# Altium project OBC_v8.PrjPcb
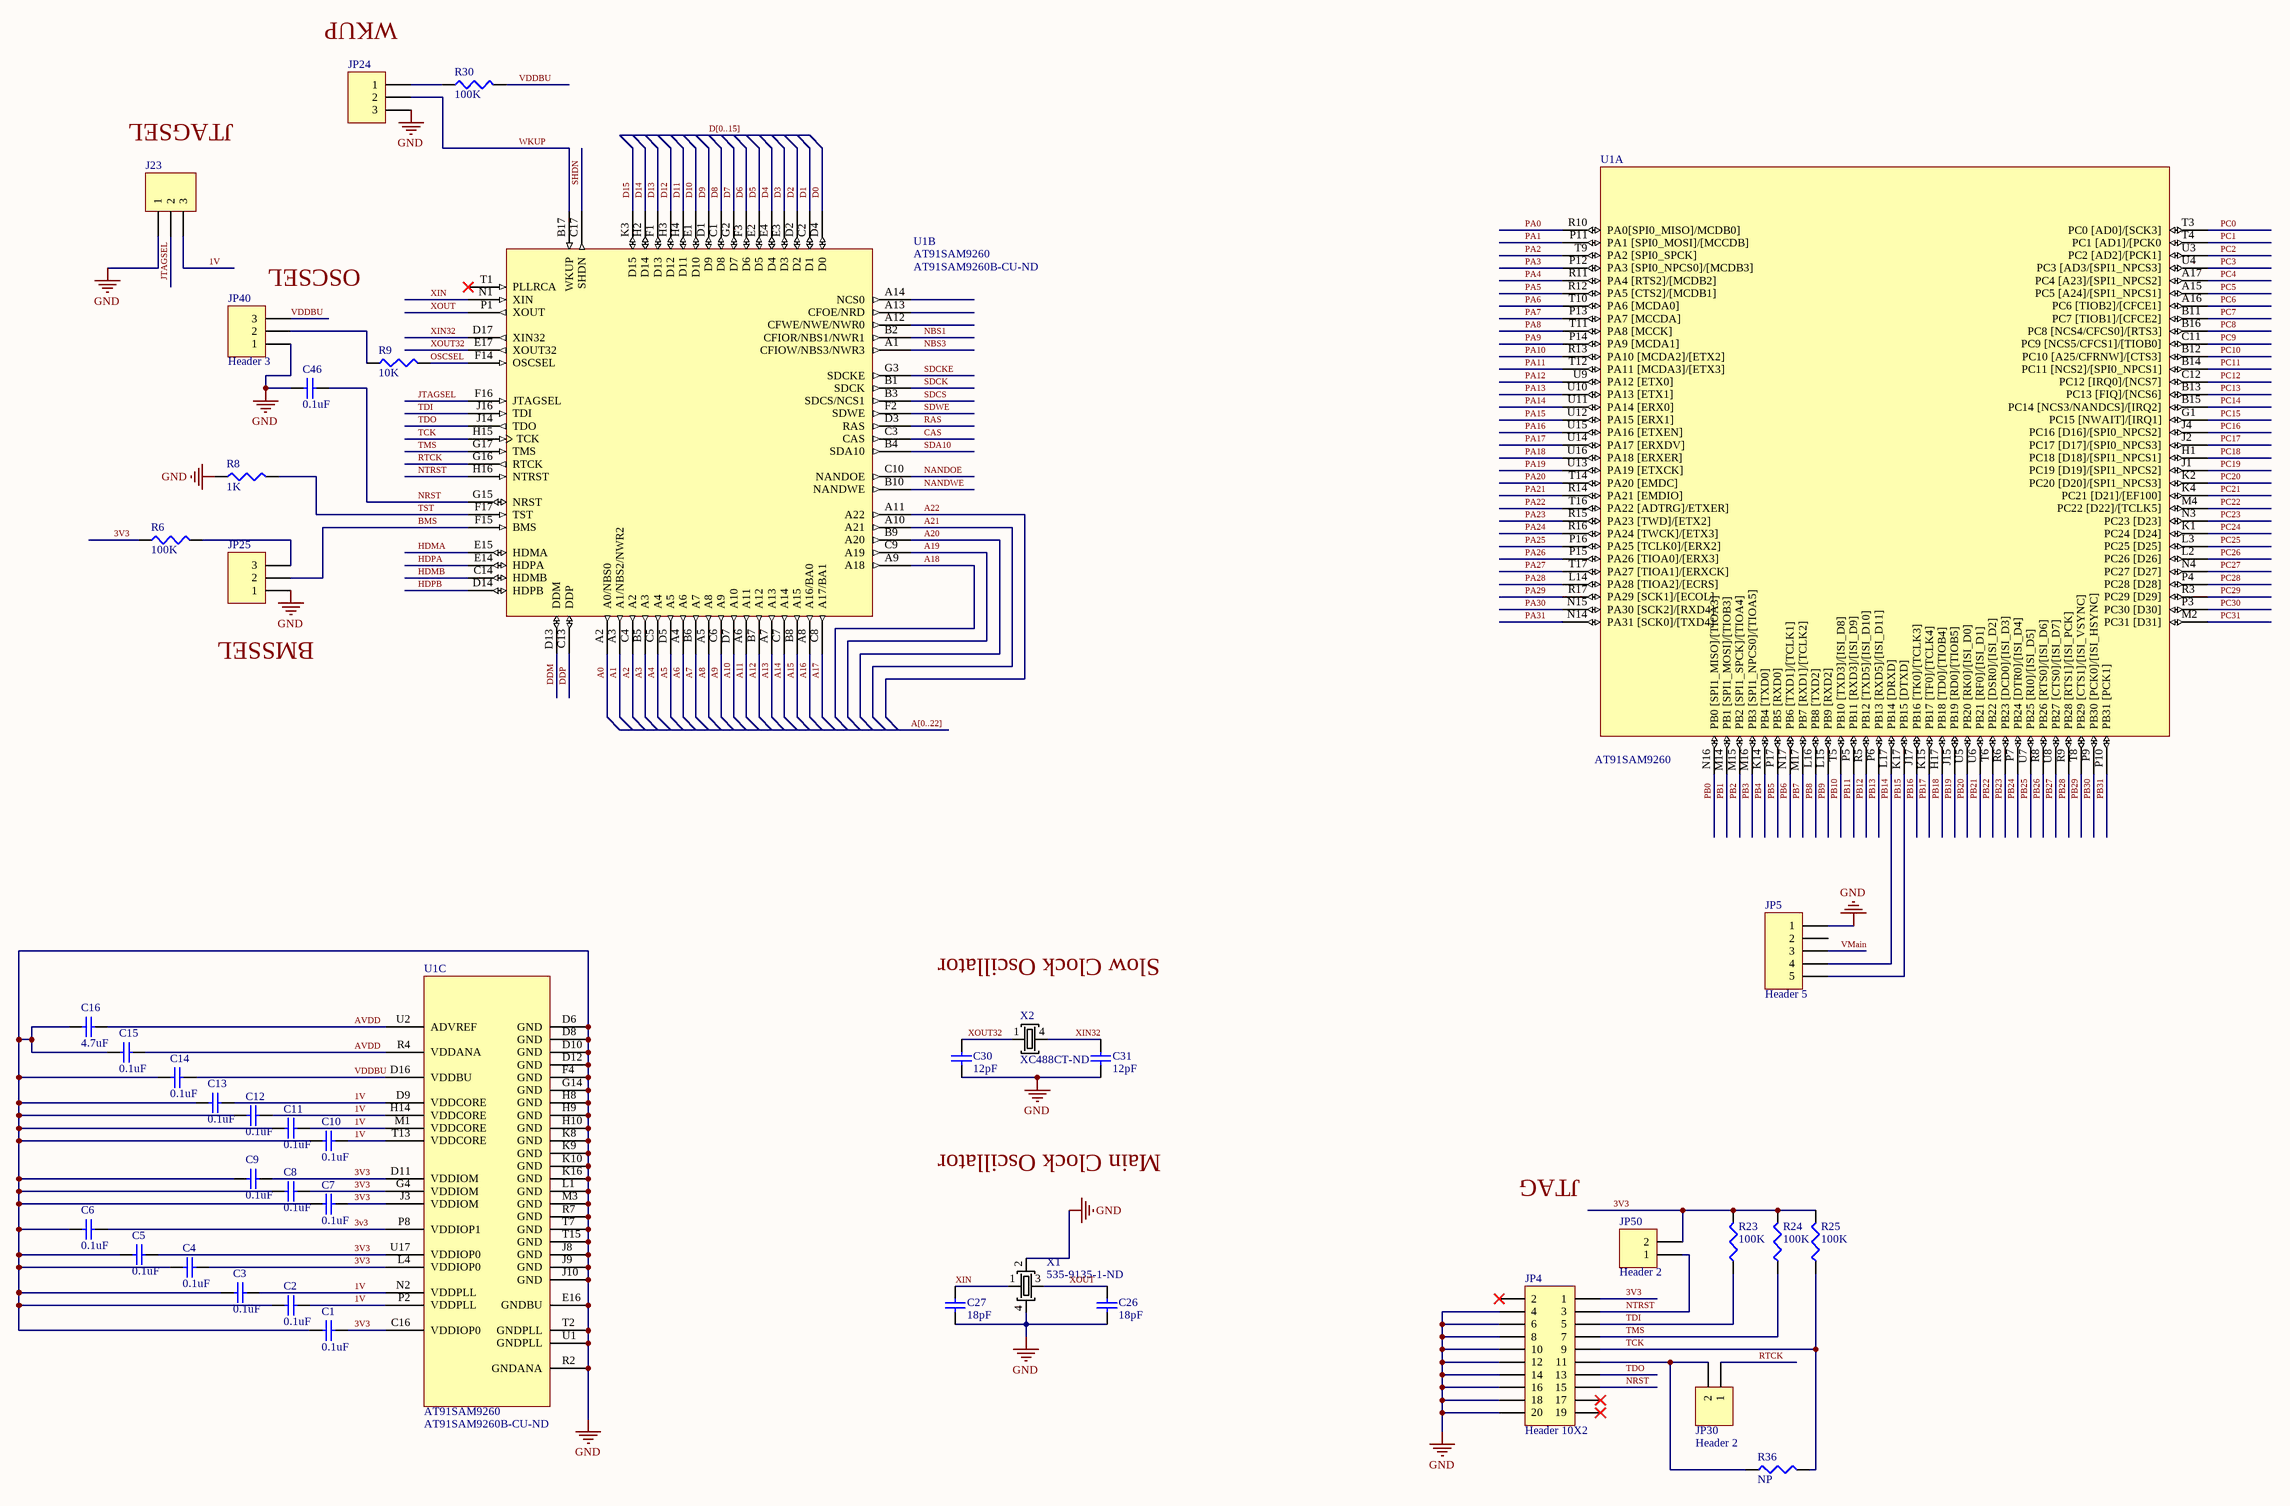
[diagram p0: MCU.SchDoc]
4 sheets, 107 parts. Net scope: global (net labels, ports and power ports of the same name join across sheets).
Board file: OBC_v8.PcbDoc
Sheets:
  MCU.SchDoc
  Power_Regulator.SchDoc
  SDCARD.SchDoc
  Ethernet.SchDoc

## Sheet MCU.SchDoc: YUsend-QB50 OBC
size A2; DrawnBy: Konstantin Borschiov; Revision: B; SheetNumber: 1; SheetTotal: 2

### Parts
C1  value 0.1uF  [0402]  (hidden comment: C0402_c_0.1uF)
C2  value 0.1uF  [0402]  (hidden comment: C0402_c_0.1uF)
C3  value 0.1uF  [0402]  (hidden comment: C0402_c_0.1uF)
C4  value 0.1uF  [0402]  (hidden comment: C0402_c_0.1uF)
C5  value 0.1uF  [0402]  (hidden comment: C0402_c_0.1uF)
C6  value 0.1uF  [0402]  (hidden comment: C0402_c_0.1uF)
C7  value 0.1uF  [0402]  (hidden comment: C0402_c_0.1uF)
C8  value 0.1uF  [0402]  (hidden comment: C0402_c_0.1uF)
C9  value 0.1uF  [0402]  (hidden comment: C0402_c_0.1uF)
C10  value 0.1uF  [0402]  (hidden comment: C0402_c_0.1uF)
C11  value 0.1uF  [0402]  (hidden comment: C0402_c_0.1uF)
C12  value 0.1uF  [0402]  (hidden comment: C0402_c_0.1uF)
C13  value 0.1uF  [0402]  (hidden comment: C0402_c_0.1uF)
C14  value 0.1uF  [0402]  (hidden comment: C0402_c_0.1uF)
C15  value 0.1uF  [0402]  (hidden comment: C0402_c_0.1uF)
C16  value 4.7uF  [0402]  (hidden comment: C0402_c_4.7uF)
C26  value 18pF  [0402]  (hidden comment: C0402_a_18pF)
C27  value 18pF  [0402]  (hidden comment: C0402_a_18pF)
C30  value 12pF  [0402]  (hidden comment: C0402_a_12pF)
C31  value 12pF  [0402]  (hidden comment: C0402_a_12pF)
C46  value 0.1uF  [0402]  (hidden comment: C0402_c_0.1uF)
J23  Header 3  [HDR1X3]  (value not drawn)
JP4  Header 10X2  [HDR2X10]
JP5  Header 5  [HDR1X5]
JP24  Header 3  [HDR1X3]  (value not drawn)
JP25  Header 3  [HDR1X3]  (value not drawn)
JP30  Header 2  [HDR1X2]
JP40  Header 3  [HDR1X3]
JP50  Header 2  [HDR1X2]
R6  value 100K  [RES0805]  (hidden comment: Susumu_0805_b3_100K)
R8  value 1K  [RES0805]  (hidden comment: Susumu_0805_b1_1K)
R9  value 10K  [RES0805]  (hidden comment: Susumu_0805_b2_10K)
R23  value 100K  [RES0805]  (hidden comment: Susumu_0805_b3_100K)
R24  value 100K  [RES0805]  (hidden comment: Susumu_0805_b3_100K)
R25  value 100K  [RES0805]  (hidden comment: Susumu_0805_b3_100K)
R30  value 100K  [RES0805]  (hidden comment: Susumu_0805_b3_100K)
R36  value NP  [RES0805]  (hidden comment: 0805_NP)
U1  AT91SAM9260  [BGA217C80P17X17_1500X1500X140]  (parts A,B,C of 3)
X1  Supplier Part Number 1: 535-9135-1-ND  [Crystal Footprint]  (hidden comment: Crystal_18.432MHz)
X2  Supplier Part Number 1: XC488CT-ND  [ECX-306]  (hidden comment: Crystal_32.768KHz)

### Nets
GND: C1.1 C2.1 C3.1 C4.1 C5.1 C6.1 C7.1 C8.1 C9.1 C10.1 C11.1 C12.1 C13.1 C14.1 C15.1 C16.1 C26.1 C27.1 C30.1 C31.1 C46.1 J23.1 JP4.4 JP4.6 JP4.8 JP4.10 JP4.12 JP4.14 JP4.16 JP4.18 JP4.20 JP5.1 JP24.3 JP25.1 JP40.1 R8.1 U1.D6(GND) U1.D8(GND) U1.D10(GND) U1.D12(GND) U1.E16(GNDBU) U1.F4(GND) U1.G14(GND) U1.H8(GND) U1.H9(GND) U1.H10(GND) U1.J8(GND) U1.J9(GND) U1.J10(GND) U1.K8(GND) U1.K9(GND) U1.K10(GND) U1.K16(GND) U1.L1(GND) U1.M3(GND) U1.R2(GNDANA) U1.R7(GND) U1.T2(GNDPLL) U1.T7(GND) U1.T15(GND) U1.U1(GNDPLL) X1.2(GND) X1.4(GND)
1V: C2.2 C3.2 C10.2 C11.2 C12.2 C13.2 J23.3 U1.D9(VDDCORE) U1.H14(VDDCORE) U1.M1(VDDCORE) U1.N2(VDDPLL) U1.P2(VDDPLL) U1.T13(VDDCORE)
3V3: C1.2 C4.2 C5.2 C6.2 C7.2 C8.2 C9.2 JP4.1 JP50.2 R6.1 R23.2 R24.2 R25.2 U1.C16(VDDIOP0) U1.D11(VDDIOM) U1.G4(VDDIOM) U1.J3(VDDIOM) U1.L4(VDDIOP0) U1.P8(VDDIOP1) U1.U17(VDDIOP0)
A0: U1.A2(A0/NBS0)
A1: U1.A3(A1/NBS2/NWR2)
A2: U1.C4(A2)
A3: U1.B5(A3)
A4: U1.C5(A4)
A5: U1.D5(A5)
A6: U1.A4(A6)
A7: U1.B6(A7)
A8: U1.A5(A8)
A9: U1.C6(A9)
A10: U1.D7(A10)
A11: U1.A6(A11)
A12: U1.B7(A12)
A13: U1.A7(A13)
A14: U1.C7(A14)
A15: U1.B8(A15)
A16: U1.A8(A16/BA0)
A17: U1.C8(A17/BA1)
A18: U1.A9(A18)
A19: U1.C9(A19)
A20: U1.B9(A20)
A21: U1.A10(A21)
A22: U1.A11(A22)
AVDD: C15.2 C16.2 U1.R4(VDDANA) U1.U2(ADVREF)
BMS: JP25.2 U1.F15(BMS)
CAS: U1.C3(CAS)
D0: U1.D4(D0)
D1: U1.C2(D1)
D2: U1.D2
D3: U1.E3(D3)
D4: U1.E4(D4)
D5: U1.E2(D5)
D6: U1.F3(D6)
D7: U1.G2(D7)
D8: U1.C1(D8)
D9: U1.D1(D9)
D10: U1.E1(D10)
D11: U1.H4(D11)
D12: U1.H3(D12)
D13: U1.F1(D13)
D14: U1.H2(D14)
D15: U1.K3(D15)
DDM: U1.D13(DDM)
DDP: U1.C13(DDP)
HDMA: U1.E15(HDMA)
HDMB: U1.C14(HDMB)
HDPA: U1.E14(HDPA)
HDPB: U1.D14(HDPB)
JTAGSEL: J23.2 U1.F16(JTAGSEL)
NANDOE: U1.C10(NANDOE)
NANDWE: U1.B10(NANDWE)
NBS1: U1.B2(CFIOR/NBS1/NWR1)
NBS3: U1.A1(CFIOW/NBS3/NWR3)
NRST: C46.2 JP4.15 U1.G15(NRST)
NTRST: JP4.3 JP50.1 U1.H16(NTRST)
OSCSEL: R9.2 U1.F14(OSCSEL)
PA0: U1.R10(PA0[SPI0_MISO]/MCDB0])
PA1: U1.P11(PA1_[SPI0_MOSI]/[MCCDB])
PA2: U1.T9(PA2_[SPI0_SPCK])
PA3: U1.P12(PA3_[SPI0_NPCS0]/[MCDB3])
PA4: U1.R11(PA4_[RTS2]/[MCDB2])
PA5: U1.R12(PA5_[CTS2]/[MCDB1])
PA6: U1.T10(PA6_[MCDA0])
PA7: U1.P13(PA7_[MCCDA])
PA8: U1.T11(PA8_[MCCK])
PA9: U1.P14(PA9_[MCDA1])
PA10: U1.R13(PA10_[MCDA2]/[ETX2])
PA11: U1.T12(PA11_[MCDA3]/[ETX3])
PA12: U1.U9(PA12_[ETX0])
PA13: U1.U10(PA13_[ETX1])
PA14: U1.U11(PA14_[ERX0])
PA15: U1.U12(PA15_[ERX1])
PA16: U1.U15(PA16_[ETXEN])
PA17: U1.U14(PA17_[ERXDV])
PA18: U1.U16(PA18_[ERXER])
PA19: U1.U13(PA19_[ETXCK])
PA20: U1.T14(PA20_[EMDC])
PA21: U1.R14(PA21_[EMDIO])
PA22: U1.T16(PA22_[ADTRG]/ETXER])
PA23: U1.R15(PA23_[TWD]/[ETX2])
PA24: U1.R16(PA24_[TWCK]/[ETX3])
PA25: U1.P16(PA25_[TCLK0]/[ERX2])
PA26: U1.P15(PA26_[TIOA0]/[ERX3])
PA27: U1.T17(PA27_[TIOA1]/[ERXCK])
PA28: U1.L14(PA28_[TIOA2]/[ECRS])
PA29: U1.R17(PA29_[SCK1]/[ECOL])
PA30: U1.N15(PA30_[SCK2]/[RXD4])
PA31: U1.N14(PA31_[SCK0]/[TXD4])
PB0: U1.N16(PB0_[SPI1_MISO]/[TIOA3])
PB1: U1.M14(PB1_[SPI1_MOSI]/[TIOB3])
PB2: U1.M15(PB2_[SPI1_SPCK]/[TIOA4])
PB3: U1.M16(PB3_[SPI1_NPCS0]/[TIOA5])
PB4: U1.K14(PB4_[TXD0])
PB5: U1.P17(PB5_[RXD0])
PB6: U1.N17(PB6_[TXD1]/[TCLK1])
PB7: U1.M17(PB7_[RXD1]/[TCLK2])
PB8: U1.L16(PB8_[TXD2])
PB9: U1.L15(PB9_[RXD2])
PB10: U1.T5(PB10_[TXD3]/[ISI_D8])
PB11: U1.P5(PB11_[RXD3]/[ISI_D9])
PB12: U1.R5(PB12_[TXD5]/[ISI_D10])
PB13: U1.P6(PB13_[RXD5]/[ISI_D11])
PB14: JP5.4 U1.L17(PB14_[DRXD])
PB15: JP5.5 U1.K17(PB15_[DTXD])
PB16: U1.J17(PB16_[TK0]/[TCLK3])
PB17: U1.K15(PB17_[TF0]/[TCLK4])
PB18: U1.H17(PB18_[TD0]/[TIOB4])
PB19: U1.J15(PB19_[RD0]/[TIOB5])
PB20: U1.U5(PB20_[RK0]/[ISI_D0])
PB21: U1.U6(PB21_[RF0]/[ISI_D1])
PB22: U1.T6(PB22_[DSR0]/[ISI_D2])
PB23: U1.R6(PB23_[DCD0]/[ISI_D3])
PB24: U1.P7(PB24_[DTR0]/[ISI_D4])
PB25: U1.U7(PB25_[RI0]/[ISI_D5])
PB26: U1.R8(PB26_[RTS0]/[ISI_D6])
PB27: U1.U8(PB27_[CTS0]/[ISI_D7])
PB28: U1.R9(PB28_[RTS1]/[ISI_PCK])
PB29: U1.T8(PB29_[CTS1]/[ISI_VSYNC])
PB30: U1.P9(PB30_[PCK0]/[ISI_HSYNC])
PB31: U1.P10(PB31_[PCK1])
PC0: U1.T3(PC0_[AD0]/[SCK3])
PC1: U1.T4(PC1_[AD1]/[PCK0)
PC2: U1.U3(PC2_[AD2]/[PCK1])
PC3: U1.U4(PC3_[AD3/[SPI1_NPCS3])
PC4: U1.A17(PC4_[A23]/[SPI1_NPCS2])
PC5: U1.A15(PC5_[A24]/[SPI1_NPCS1])
PC6: U1.A16(PC6_[TIOB2]/[CFCE1])
PC7: U1.B11(PC7_[TIOB1]/[CFCE2])
PC8: U1.B16(PC8_[NCS4/CFCS0]/[RTS3])
PC9: U1.C11(PC9_[NCS5/CFCS1]/[TIOB0])
PC10: U1.B12(PC10_[A25/CFRNW]/[CTS3])
PC11: U1.B14(PC11_[NCS2]/[SPI0_NPCS1])
PC12: U1.C12(PC12_[IRQ0]/[NCS7])
PC13: U1.B13(PC13_[FIQ]/[NCS6])
PC14: U1.B15(PC14_[NCS3/NANDCS]/[IRQ2])
PC15: U1.G1(PC15_[NWAIT]/[IRQ1])
PC16: U1.J4(PC16_[D16]/[SPI0_NPCS2])
PC17: U1.J2(PC17_[D17]/[SPI0_NPCS3])
PC18: U1.H1(PC18_[D18]/[SPI1_NPCS1])
PC19: U1.J1(PC19_[D19]/[SPI1_NPCS2])
PC20: U1.K2(PC20_[D20]/[SPI1_NPCS3])
PC21: U1.K4(PC21_[D21]/[EF100])
PC22: U1.M4(PC22_[D22]/[TCLK5])
PC23: U1.N3(PC23_[D23])
PC24: U1.K1(PC24_[D24])
PC25: U1.L3(PC25_[D25])
PC26: U1.L2(PC26_[D26])
PC27: U1.N4(PC27_[D27])
PC28: U1.P4(PC28_[D28])
PC29: U1.R3(PC29_[D29])
PC30: U1.P3(PC30_[D30])
PC31: U1.M2(PC31_[D31])
RAS: U1.D3(RAS)
RTCK: JP30.1 U1.G16(RTCK)
SDA10: U1.B4(SDA10)
SDCK: U1.B1(SDCK)
SDCKE: U1.G3(SDCKE)
SDCS: U1.B3(SDCS/NCS1)
SDWE: U1.F2(SDWE)
SHDN: U1.C17(SHDN)
TCK: JP4.9 R25.1 R36.2 U1.H15(TCK)
TDI: JP4.5 R23.1 U1.J16(TDI)
TDO: JP4.13 U1.J14(TDO)
TMS: JP4.7 R24.1 U1.G17(TMS)
TST: R8.2 U1.F17(TST)
VDDBU: C14.2 JP40.3 R30.2 U1.D16(VDDBU)
VMain: JP5.3
WKUP: JP24.2 U1.B17(WKUP)
XIN: C27.2 U1.N1(XIN) X1.1
XIN32: C31.2 U1.D17(XIN32) X2.4(GND)
XOUT: C26.2 U1.P1(XOUT) X1.3
XOUT32: C30.2 U1.E17(XOUT32) X2.1
NetJP4_11: JP4.11 JP30.2 R36.1
NetJP24_1: JP24.1 R30.1
NetJP25_3: JP25.3 R6.2
NetJP40_2: JP40.2 R9.1

Not connected (* = marked no-connect by the designer): JP4 2* 17* 19*; JP5 2; U1 A12(CFWE/NWE/NWR0) A13(CFOE/NRD) A14(NCS0) T1(PLLRCA)*

### Buses and harness runs
bus A[0..22]
bus D[0..15]

### Notes on the sheet
- (near JP24) WKUP
- JTAGSEL
- (near JP40) OSCSEL
- (near JP25) BMSSEL
- Slow Clock Oscillator
- Main Clock Oscillator
- JTAG

### Library data of the parts
C1-C15 C46 = C0402_c_0.1uF: Ceramic Chip Capacitor - 0.1uF; Note: Footprint corresponds to dimensions for bulk cassette packaging. This case size has tightened tolerances.; Published: 17-Jul-2002; LatestRevisionDate: 19-Mar-2004; LatestRevisionNote: Silkscreen size reduced.; DatasheetDocument: Mar-2001; PackageDocument: Mar-2001; PackageReference: 0402; Publisher: Altium Limited; Code_JEITA: 0402; Code_IPC: 1005 [0402]; ComponentLink1Description: Manufacturer Link; ComponentLink1URL: http://www.kemet.com/; ComponentLink2Description: Datasheet; ComponentLink2URL: http://www.kemet.com/kemet/web/homepage/kechome.nsf/vapubfilesname/F3102TA.pdf/$file/F3102TA.pdf; Supplier 1: Digi-Key; Supplier Part Number 1: 399-3521-1-ND
C16 = C0402_c_4.7uF: Ceramic Chip Capacitor - 4.7uF; Note: Footprint corresponds to dimensions for bulk cassette packaging. This case size has tightened tolerances.; Published: 17-Jul-2002; LatestRevisionDate: 19-Mar-2004; LatestRevisionNote: Silkscreen size reduced.; DatasheetDocument: Mar-2001; PackageDocument: Mar-2001; PackageReference: 0402; Publisher: Altium Limited; Code_JEITA: 0402; Code_IPC: 1005 [0402]; ComponentLink1Description: Manufacturer Link; ComponentLink1URL: http://www.kemet.com/; ComponentLink2Description: Datasheet; ComponentLink2URL: http://www.kemet.com/kemet/web/homepage/kechome.nsf/vapubfilesname/F3102TA.pdf/$file/F3102TA.pdf; Supplier 1: Digi-Key; Supplier Part Number 1: 490-5408-1-ND
C26 C27 = C0402_a_18pF: Ceramic Chip Capacitor - 18pF; Note: Footprint corresponds to dimensions for bulk cassette packaging. This case size has tightened tolerances.; Published: 17-Jul-2002; LatestRevisionDate: 19-Mar-2004; LatestRevisionNote: Silkscreen size reduced.; DatasheetDocument: Mar-2001; PackageDocument: Mar-2001; PackageReference: 0402; Publisher: Altium Limited; Code_JEITA: 0402; Code_IPC: 1005 [0402]; ComponentLink1Description: Manufacturer Link; ComponentLink1URL: http://www.kemet.com/; ComponentLink2Description: Datasheet; ComponentLink2URL: http://www.kemet.com/kemet/web/homepage/kechome.nsf/vapubfilesname/F3102TA.pdf/$file/F3102TA.pdf; Supplier 1: Digi-Key; Supplier Part Number 1: 490-1281-1-ND
C30 C31 = C0402_a_12pF: Ceramic Chip Capacitor - 12pF; Note: Footprint corresponds to dimensions for bulk cassette packaging. This case size has tightened tolerances.; Published: 17-Jul-2002; LatestRevisionDate: 19-Mar-2004; LatestRevisionNote: Silkscreen size reduced.; DatasheetDocument: Mar-2001; PackageDocument: Mar-2001; PackageReference: 0402; Publisher: Altium Limited; Code_JEITA: 0402; Code_IPC: 1005 [0402]; ComponentLink1Description: Manufacturer Link; ComponentLink1URL: http://www.kemet.com/; ComponentLink2Description: Datasheet; ComponentLink2URL: http://www.kemet.com/kemet/web/homepage/kechome.nsf/vapubfilesname/F3102TA.pdf/$file/F3102TA.pdf; Supplier 1: Digi-Key; Supplier Part Number 1: 490-1279-1-ND
J23 JP24 JP25 JP40 = Header 3: Header, 3-Pin; LatestRevisionDate: 17-Jul-2002; LatestRevisionNote: Re-released for DXP Platform.; Publisher: Altium Limited
JP4 = Header 10X2: Header, 10-Pin, Dual row; LatestRevisionDate: 17-Jul-2002; LatestRevisionNote: Re-released for DXP Platform.; Publisher: Altium Limited
JP5 = Header 5: Header, 5-Pin; LatestRevisionDate: 17-Jul-2002; LatestRevisionNote: Re-released for DXP Platform.; Publisher: Altium Limited
JP30 JP50 = Header 2: Header, 2-Pin; LatestRevisionDate: 17-Jul-2002; LatestRevisionNote: Re-released for DXP Platform.; Publisher: Altium Limited
R6 R23-R25 R30 = Susumu_0805_b3_100K: RES 100K OHM 1/10W .5% 0805 SMD; Supplier 1: Digi-Key; Supplier Part Number 1: RR12P100KDCT-ND
R8 = Susumu_0805_b1_1K: RES 1.0K OHM 1/10W .5% 0805 SMD; Supplier 1: Digi-Key; Supplier Part Number 1: RR12P1.0KDCT-ND
R9 = Susumu_0805_b2_10K: RES 10.0K OHM 1/10W .5% 0805 SMD; Supplier 1: Digi-Key; Supplier Part Number 1: RR12P10.0KDCT-ND
R36 = 0805_NP: No populate
U1 = AT91SAM9260: ARM926EJ-S 32 bit RISC CPU, 217-Ball BGA; Note: The pin names in [ ] brackets indicate peripheral multiplexing function.; ComponentLink1Description: Manufacturer Link; ComponentLink1URL: http://www.atmel.com; ComponentLink2Description: Datasheet; ComponentLink2URL: http://www.atmel.com/dyn/resources/prod_documents/doc6221.pdf; DatasheetVersion: 6221I-ATARM-17-Jul-09; PackageDescription: 217-Ball Ball Grid Array 0.8 mm Pitch; PackageReference: BGA217; Supplier 1: Digi-Key
X1 = Crystal_18.432MHz: Crystal 18.432MHz 18PF SMD; Manufacturer: Abracon Corporation; Value: 18.432MHz; Supplier 1: Digi-Key
X2 = Crystal_32.768KHz: Crystal 32.768KHz 12.5PF SMD; Value: 32.768KHz; Supplier 1: Digi-Key

## Sheet Power_Regulator.SchDoc: Power Regulator
size A4; SheetNumber: 2; SheetTotal: 2
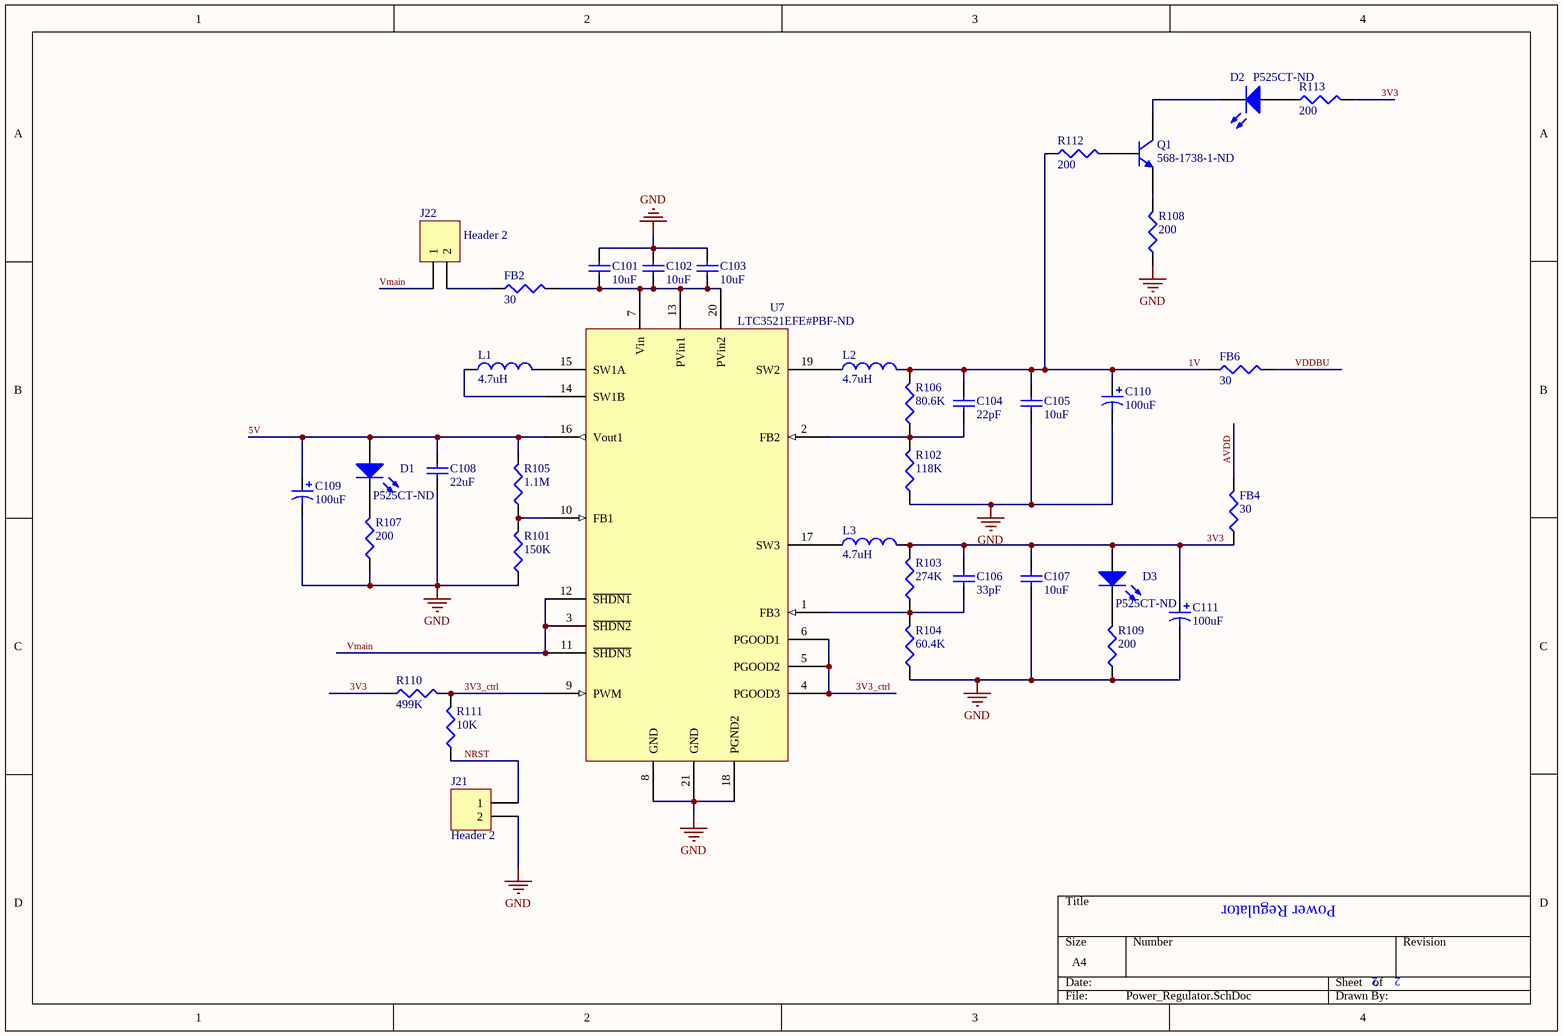
[diagram p1: Power_Regulator.SchDoc]

### Parts
C101  value 10uF  [0805]  (hidden comment: C0805_c_10uF)
C102  value 10uF  [0805]  (hidden comment: C0805_c_10uF)
C103  value 10uF  [0805]  (hidden comment: C0805_c_10uF)
C104  value 22pF  [CAPC2008X06N]  (hidden comment: AVX_0805_a2_22pf)
C105  value 10uF  [0805]  (hidden comment: C0805_c_10uF)
C106  value 33pF  [CAPC2008X06N]  (hidden comment: AVX_0805_a3_33pf)
C107  value 10uF  [0805]  (hidden comment: C0805_c_10uF)
C108  value 22uF  [0805]  (hidden comment: C0805_c_22uF)
C109  value 100uF  [6032]  (hidden comment: TantCap_6032_100uF)
C110  value 100uF  [6032]  (hidden comment: TantCap_6032_100uF)
C111  value 100uF  [6032]  (hidden comment: TantCap_6032_100uF)
D1  Supplier Part Number 1: P525CT-ND  [LED]  (hidden comment: LED_Green)
D2  Supplier Part Number 1: P525CT-ND  [LED]  (hidden comment: LED_Green)
D3  Supplier Part Number 1: P525CT-ND  [LED]  (hidden comment: LED_Green)
FB2  Value @ 100MHz: 30  [0805]  (hidden comment: Murata_a_0805_30_Ohm_100Mhz)
FB4  Value @ 100MHz: 30  [0805]  (hidden comment: Murata_a_0805_30_Ohm_100Mhz)
FB6  Value @ 100MHz: 30  [0805]  (hidden comment: Murata_a_0805_30_Ohm_100Mhz)
J21  Header 2  [HDR1X2]
J22  Header 2  [HDR1X2]
L1  value 4.7uH  [L1812]  (hidden comment: L1812_4.7uH)
L2  value 4.7uH  [L1812]  (hidden comment: L1812_4.7uH)
L3  value 4.7uH  [L1812]  (hidden comment: L1812_4.7uH)
Q1  Supplier Part Number 1: 568-1738-1-ND  [SOT95P230X110-3N]  (hidden comment: NPN Transistor)
R101  value 150K  [RES0805]  (hidden comment: Panasonic_0805_b_150K)
R102  value 118K  [RES0805]  (hidden comment: Susumu_0805_c_118K)
R103  value 274K  [RES0805]  (hidden comment: TE_0805_a_274K)
R104  value 60.4K  [RES0805]  (hidden comment: Susumu_0805_a_60.4K)
R105  value 1.1M  [RES0805]  (hidden comment: TE_0805_c_1.1K)
R106  value 80.6K  [RES0805]  (hidden comment: Susumu_0805_b_80.6K)
R107  value 200  [RES0805]  (hidden comment: Susumu_0805_a3_200)
R108  value 200  [RES0805]  (hidden comment: Susumu_0805_a3_200)
R109  value 200  [RES0805]  (hidden comment: Susumu_0805_a3_200)
R110  value 499K  [RES0805]  (hidden comment: Susumu_0805_c3_499K)
R111  value 10K  [RES0805]  (hidden comment: Susumu_0805_b2_10K)
R112  value 200  [RES0805]  (hidden comment: Susumu_0805_a3_200)
R113  value 200  [RES0805]  (hidden comment: Susumu_0805_a3_200)
U7  Supplier Part Number 1: LTC3521EFE#PBF-ND  [LTC3521EFE#PBF - duplicate]  (hidden comment: LTC3521EFE#PBF)

### Nets
GND: C101.2 C102.2 C103.2 C105.1 C107.1 C108.1 C109.2 C110.2 C111.2 J21.2 R101.1 R102.1 R104.1 R107.1 R108.1 R109.1 U7.8(GND) U7.18(PGND2) U7.21(GND)
1V: C104.2 C105.2 C110.1 FB6.1 L2.2 R106.2 R112.1
3V3: C106.2 C107.2 C111.1 D3.1(A) FB4.1 L3.2 R103.2 R110.1 R113.2
3V3_ctrl: R110.2 R111.2 U7.4(PGOOD3) U7.5(PGOOD2) U7.6(PGOOD1) U7.9(PWM)
5V: C108.2 C109.1 D1.1(A) R105.2 U7.16(Vout1)
AVDD: FB4.2
NRST: J21.1 R111.1
VDDBU: FB6.2
VMain: J22.1 U7.3(~{SHDN2}) U7.11(~{SHDN3}) U7.12(~{SHDN1})
NetC101_1: C101.1 C102.1 C103.1 FB2.2 U7.7(Vin) U7.13(PVin1) U7.20(PVin2)
NetC104_1: C104.1 R102.2 R106.1 U7.2(FB2)
NetC106_1: C106.1 R103.1 R104.2 U7.1(FB3)
NetD1_2: D1.2(K) R107.2
NetD2_1: D2.1(A) R113.1
NetD2_2: D2.2(K) Q1.3(C)
NetD3_2: D3.2(K) R109.2
NetFB2_1: FB2.1 J22.2
NetL1_1: L1.1 U7.14(SW1B)
NetL1_2: L1.2 U7.15(SW1A)
NetL2_1: L2.1 U7.19(SW2)
NetL3_1: L3.1 U7.17(SW3)
NetQ1_1: Q1.1(B) R112.2
NetQ1_2: Q1.2(E) R108.2
NetR101_2: R101.2 R105.1 U7.10(FB1)

### Library data of the parts
C101-C103 C105 C107 = C0805_c_10uF: Ceramic Chip Capacitor - 10uF; Note: Footprint corresponds to dimensions for bulk cassette packaging. This case size has tightened tolerances.; Published: 17-Jul-2002; LatestRevisionDate: 19-Mar-2004; LatestRevisionNote: Silkscreen size reduced.; DatasheetDocument: Mar-2001; PackageDocument: Mar-2001; PackageReference: 0805; Publisher: Altium Limited; Code_JEITA: 0805; Code_IPC: 2012[0805]; ComponentLink1Description: Manufacturer Link; ComponentLink1URL: http://www.kemet.com/; ComponentLink2Description: Datasheet; ComponentLink2URL: http://www.kemet.com/kemet/web/homepage/kechome.nsf/vapubfilesname/F3102TA.pdf/$file/F3102TA.pdf; Supplier 1: Digi-Key; Supplier Part Number 1: 587-1299-1-ND
C104 = AVX_0805_a2_22pf: CAP CER 22PF 50V 5% NP0 0805; Supplier 1: Digi-Key; Supplier Part Number 1: 478-1308-1-ND
C106 = AVX_0805_a3_33pf: CAP CER 33PF 50V 5% NP0 0805; Supplier 1: Digi-Key; Supplier Part Number 1: 478-1310-1-ND
C108 = C0805_c_22uF: Ceramic Chip Capacitor - 22uF; Note: Footprint corresponds to dimensions for bulk cassette packaging. This case size has tightened tolerances.; Published: 17-Jul-2002; LatestRevisionDate: 19-Mar-2004; LatestRevisionNote: Silkscreen size reduced.; DatasheetDocument: Mar-2001; PackageDocument: Mar-2001; PackageReference: 0805; Publisher: Altium Limited; Code_JEITA: 0805; Code_IPC: 2012[0805]; ComponentLink1Description: Manufacturer Link; ComponentLink1URL: http://www.kemet.com/; ComponentLink2Description: Datasheet; ComponentLink2URL: http://www.kemet.com/kemet/web/homepage/kechome.nsf/vapubfilesname/F3102TA.pdf/$file/F3102TA.pdf; Supplier 1: Digi-Key; Supplier Part Number 1: 587-1468-1-ND
C109-C111 = TantCap_6032_100uF: CAP TANT 100UF 10V 10% LOESR SMD; Code_JEITA: 6032; ComponentLink1Description: Manufacturer Link; ComponentLink1URL: http://www.kemet.com; ComponentLink2Description: Datasheet; ComponentLink2URL: http://www.kemet.com/kemet/web/homepage/kechome.nsf/vapubfiles/B45197A_SpeedPower.pdf/$file/B45197A_SpeedPower.pdf; Supplier 1: Digi-Key; Supplier Part Number 1: 495-1528-1-ND
D1-D3 = LED_Green: LED GREEN HI BRT SS TYPE LO CUR; Manufacturer: Panasonic; Colour: green; Supplier 1: Digi-Key
FB2 FB4 FB6 = Murata_a_0805_30_Ohm_100Mhz: FERRITE CHIP 30 OHM 3000MA 0805; Supplier 1: Digi-Key; Supplier Part Number 1: 490-1052-1-ND
J21 J22 = Header 2: Header, 2-Pin; LatestRevisionDate: 17-Jul-2002; LatestRevisionNote: Re-released for DXP Platform.; Publisher: Altium Limited
L1-L3 = L1812_4.7uH: Inductor unshielded 4.7mH 1812 SMD; ComponentLink1Description: Manufacturer Link; ComponentLink1URL: http://www.delevan.com; ComponentLink2Description: Datasheet; ComponentLink2URL: http://www.delevan.com/seriesPDFs/1812.pdf; Supplier 1: Digi-Key; Supplier Part Number 1: DN42135JCT-ND
Q1 = NPN Transistor: NPN Transistor, SMD; ComponentLink1Description: Manufacturer Link; ComponentLink1URL: http://www.nxp.com/; ComponentLink2Description: Datasheet; ComponentLink2URL: http://www.nxp.com/documents/data_sheet/PMBT2222_2222A.pdf; Type: NPN; Supplier 1: Digi-Key
R101 = Panasonic_0805_b_150K: RES 150K OHM 1/8W .1% 0805 SMD; Supplier 1: Digi-Key; Supplier Part Number 1: P150KDACT-ND
R102 = Susumu_0805_c_118K: RES 118K OHM 1/10W .5% 0805 SMD; Supplier 1: Digi-Key; Supplier Part Number 1: RR12P118KDCT-ND
R103 = TE_0805_a_274K: RES 274K OHM 1/10W 0.1% 0805; Supplier 1: Digi-Key; Supplier Part Number 1: A103383CT-ND
R104 = Susumu_0805_a_60.4K: RES 60.4K OHM 1/10W .5% 0805 SMD; Supplier 1: Digi-Key; Supplier Part Number 1: RR12P60.4KDCT-ND
R105 = TE_0805_c_1.1K: RES 1.1M OHM 1/16W 0.1% 0805; Supplier 1: Digi-Key; Supplier Part Number 1: A103796CT-ND
R106 = Susumu_0805_b_80.6K: RES 80.6K OHM 1/10W .5% 0805 SMD; Supplier 1: Digi-Key; Supplier Part Number 1: RR12P80.6KDCT-ND
R107-R109 R112 R113 = Susumu_0805_a3_200: RES 200 OHM 1/10W .5% 0805 SMD; Supplier 1: Digi-Key; Supplier Part Number 1: RR12P200DCT-ND
R110 = Susumu_0805_c3_499K: RES 499K OHM 1/10W .5% 0805 SMD; Supplier 1: Digi-Key; Supplier Part Number 1: RR12P499KDCT-ND
R111 = Susumu_0805_b2_10K: RES 10.0K OHM 1/10W .5% 0805 SMD; Supplier 1: Digi-Key; Supplier Part Number 1: RR12P10.0KDCT-ND
U7 = LTC3521EFE#PBF: IC BUCK BOOST SYNC ADJ 20TSSOP; ComponentLink1Description: Manufacturer Link; ComponentLink1URL: http://www.linear.com/; ComponentLink2Description: Datasheet; ComponentLink2URL: http://cds.linear.com/docs/en/datasheet/3521fb.pdf; Supplier 1: Digi-Key

## Sheet SDCARD.SchDoc
size A4
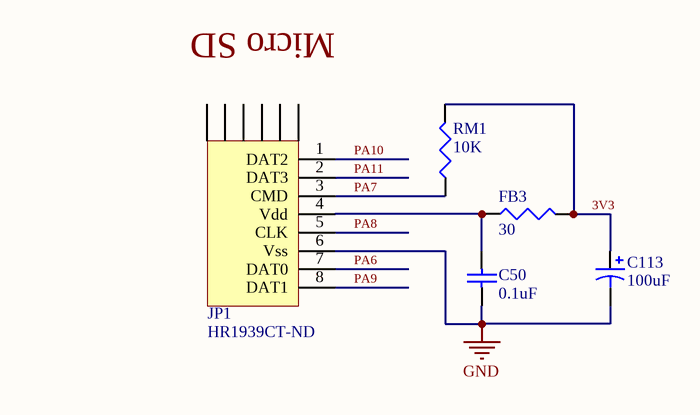
[diagram p2: SDCARD.SchDoc]

### Parts
C50  value 0.1uF  [CAPC2008X06N]  (hidden comment: Kemet_0805_a_0.1uF)
C113  value 100uF  [6032]  (hidden comment: TantCap_6032_100uF)
FB3  Value @ 100MHz: 30  [0805]  (hidden comment: Murata_a_0805_30_Ohm_100Mhz)
JP1  Supplier Part Number 1: HR1939CT-ND  [DM3AT-SF-PEJ]  (hidden comment: MicroSD Connector)
RM1  value 10K  [RES0805]  (hidden comment: Susumu_0805_b2_10K)

### Nets
GND: C50.1 C113.2 JP1.6(Vss)
3V3: C113.1 FB3.2 RM1.2
PA6: JP1.7(DAT0)
PA7: JP1.3(CMD) RM1.1
PA8: JP1.5(CLK)
PA9: JP1.8(DAT1)
PA10: JP1.1(DAT2)
PA11: JP1.2(DAT3)
NetC50_2: C50.2 FB3.1 JP1.4(Vdd)

Not connected (* = marked no-connect by the designer): JP1 C1 C2 C3 C4 C5 C6

### Notes on the sheet
- Micro SD

### Library data of the parts
C50 = Kemet_0805_a_0.1uF: CAP CER 0.1UF 50V 10% X7R 0805; Supplier 1: Digi-Key; Supplier Part Number 1: 399-1170-1-ND
C113 = TantCap_6032_100uF: CAP TANT 100UF 10V 10% LOESR SMD; Code_JEITA: 6032; ComponentLink1Description: Manufacturer Link; ComponentLink1URL: http://www.kemet.com; ComponentLink2Description: Datasheet; ComponentLink2URL: http://www.kemet.com/kemet/web/homepage/kechome.nsf/vapubfiles/B45197A_SpeedPower.pdf/$file/B45197A_SpeedPower.pdf; Supplier 1: Digi-Key; Supplier Part Number 1: 495-1528-1-ND
FB3 = Murata_a_0805_30_Ohm_100Mhz: FERRITE CHIP 30 OHM 3000MA 0805; Supplier 1: Digi-Key; Supplier Part Number 1: 490-1052-1-ND
JP1 = MicroSD Connector: CONN MICRO SD R/A PUSH-PUSH SMD; ComponentLink1Description: Manufacturer Link; ComponentLink1URL: http://www.hirose.com/; ComponentLink2Description: Datasheet; ComponentLink2URL: http://www.hirose.co.jp/cataloge_hp/e60900232.pdf; Supplier 1: Digi-Key
RM1 = Susumu_0805_b2_10K: RES 10.0K OHM 1/10W .5% 0805 SMD; Supplier 1: Digi-Key; Supplier Part Number 1: RR12P10.0KDCT-ND

## Sheet Ethernet.SchDoc
size A4
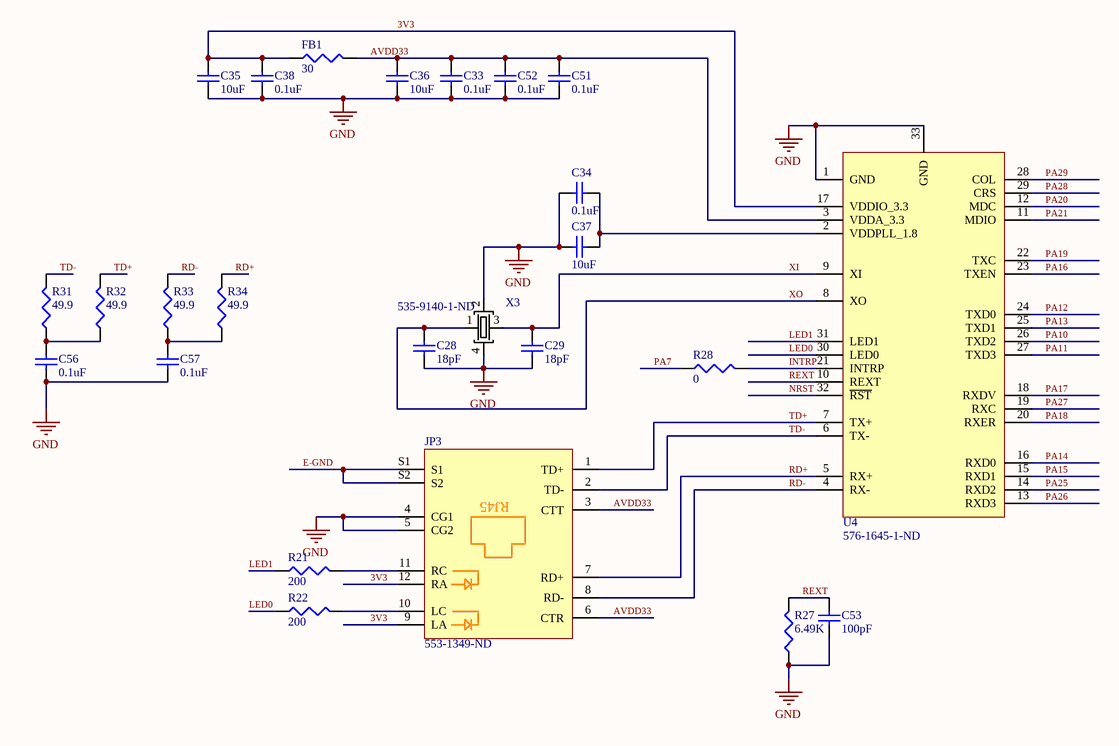
[diagram p3: Ethernet.SchDoc]

### Parts
C28  value 18pF  [0402]  (hidden comment: C0402_a_18pF)
C29  value 18pF  [0402]  (hidden comment: C0402_a_18pF)
C33  value 0.1uF  [0402]  (hidden comment: C0402_c_0.1uF)
C34  value 0.1uF  [0402]  (hidden comment: C0402_c_0.1uF)
C35  value 10uF  [0805]  (hidden comment: C0805_c_10uF)
C36  value 10uF  [0805]  (hidden comment: C0805_c_10uF)
C37  value 10uF  [0805]  (hidden comment: C0805_c_10uF)
C38  value 0.1uF  [0402]  (hidden comment: C0402_c_0.1uF)
C51  value 0.1uF  [0402]  (hidden comment: C0402_c_0.1uF)
C52  value 0.1uF  [0402]  (hidden comment: C0402_c_0.1uF)
C53  value 100pF  [0402]  (hidden comment: C0402_a_100pF)
C56  value 0.1uF  [0402]  (hidden comment: C0402_c_0.1uF)
C57  value 0.1uF  [0402]  (hidden comment: C0402_c_0.1uF)
FB1  Value @ 100MHz: 30  [0805]  (hidden comment: Murata_a_0805_30_Ohm_100Mhz)
JP3  Supplier Part Number 1: 553-1349-ND  [RJ45]  (hidden comment: Ethernet connector)
R21  value 200  [RES0805]  (hidden comment: Susumu_0805_a3_200)
R22  value 200  [RES0805]  (hidden comment: Susumu_0805_a3_200)
R27  value 6.49K  [RES0805]  (hidden comment: Stackpole_0805_b1_6.49K)
R28  value 0  [RES0805]  (hidden comment: Vishay_0805_a1_0.0)
R31  value 49.9  [RES0805]  (hidden comment: Susumu_0805_a1_49.9)
R32  value 49.9  [RES0805]  (hidden comment: Susumu_0805_a1_49.9)
R33  value 49.9  [RES0805]  (hidden comment: Susumu_0805_a1_49.9)
R34  value 49.9  [RES0805]  (hidden comment: Susumu_0805_a1_49.9)
U4  Supplier Part Number 1: 576-1645-1-ND  [QFN50P500X500X85-32N]  (hidden comment: 10Base-T/100Base-TX Physical Layer Transceiver)
X3  Supplier Part Number 1: 535-9140-1-ND  [Crystal Footprint]  (hidden comment: Crystal_25.000MHz)

### Nets
GND: C28.1 C29.1 C33.1 C34.1 C35.1 C36.1 C37.1 C38.1 C51.1 C52.1 C53.1 C56.1 C57.1 JP3.4(CG1) JP3.5(CG2) R27.1 U4.1(GND) U4.33(GND) X3.2(GND) X3.4(GND)
3V3: C35.2 C38.2 FB1.1 JP3.9(LA) JP3.12(RA) U4.17(VDDIO_3.3)
AVDD33: C33.2 C36.2 C51.2 C52.2 FB1.2 JP3.3(CTT) JP3.6(CTR) U4.3(VDDA_3.3)
E-GND: JP3.S1 JP3.S2
INTRP: R28.2 U4.21(INTRP)
LED0: R22.1 U4.30(LED0)
LED1: R21.1 U4.31(LED1)
NRST: U4.32(~{RST})
PA7: R28.1
PA10: U4.26(TXD2)
PA11: U4.27(TXD3)
PA12: U4.24(TXD0)
PA13: U4.25(TXD1)
PA14: U4.16(RXD0)
PA15: U4.15(RXD1)
PA16: U4.23(TXEN)
PA17: U4.18(RXDV)
PA18: U4.20(RXER)
PA19: U4.22(TXC)
PA20: U4.12(MDC)
PA21: U4.11(MDIO)
PA25: U4.14(RXD2)
PA26: U4.13(RXD3)
PA27: U4.19(RXC)
PA28: U4.29(CRS)
PA29: U4.28(COL)
RD+: JP3.7(RD+) R34.2 U4.5(RX+)
RD-: JP3.8(RD-) R33.2 U4.4(RX-)
REXT: C53.2 R27.2 U4.10(REXT)
TD+: JP3.1(TD+) R32.2 U4.7(TX+)
TD-: JP3.2(TD-) R31.2 U4.6(TX-)
XI: C29.2 U4.9(XI) X3.3
XO: C28.2 U4.8(XO) X3.1
NetC34_2: C34.2 C37.2 U4.2(VDDPLL_1.8)
NetC56_2: C56.2 R31.1 R32.1
NetC57_2: C57.2 R33.1 R34.1
NetJP3_10: JP3.10(LC) R22.2
NetJP3_11: JP3.11(RC) R21.2

### Notes on the sheet
- (in symbol Ethernet connector) RJ45

### Library data of the parts
C28 C29 = C0402_a_18pF: as C26 on sheet MCU; Published: 17-Jul-2002; LatestRevisionDate: 19-Mar-2004; LatestRevisionNote: Silkscreen size reduced.; DatasheetDocument: Mar-2001; PackageDocument: Mar-2001; PackageReference: 0402; Publisher: Altium Limited; Code_JEITA: 0402; Code_IPC: 1005 [0402]; ComponentLink1Description: Manufacturer Link; ComponentLink1URL: http://www.kemet.com/; ComponentLink2Description: Datasheet; ComponentLink2URL: http://www.kemet.com/kemet/web/homepage/kechome.nsf/vapubfilesname/F3102TA.pdf/$file/F3102TA.pdf; Supplier 1: Digi-Key; Supplier Part Number 1: 490-1281-1-ND
C33 C34 C38 C51 C52 C56 C57 = C0402_c_0.1uF: as C1 on sheet MCU; Published: 17-Jul-2002; LatestRevisionDate: 19-Mar-2004; LatestRevisionNote: Silkscreen size reduced.; DatasheetDocument: Mar-2001; PackageDocument: Mar-2001; PackageReference: 0402; Publisher: Altium Limited; Code_JEITA: 0402; Code_IPC: 1005 [0402]; ComponentLink1Description: Manufacturer Link; ComponentLink1URL: http://www.kemet.com/; ComponentLink2Description: Datasheet; ComponentLink2URL: http://www.kemet.com/kemet/web/homepage/kechome.nsf/vapubfilesname/F3102TA.pdf/$file/F3102TA.pdf; Supplier 1: Digi-Key; Supplier Part Number 1: 399-3521-1-ND
C35-C37 = C0805_c_10uF: as C101 on sheet Power_Regulator; Published: 17-Jul-2002; LatestRevisionDate: 19-Mar-2004; LatestRevisionNote: Silkscreen size reduced.; DatasheetDocument: Mar-2001; PackageDocument: Mar-2001; PackageReference: 0805; Publisher: Altium Limited; Code_JEITA: 0805; Code_IPC: 2012[0805]; ComponentLink1Description: Manufacturer Link; ComponentLink1URL: http://www.kemet.com/; ComponentLink2Description: Datasheet; ComponentLink2URL: http://www.kemet.com/kemet/web/homepage/kechome.nsf/vapubfilesname/F3102TA.pdf/$file/F3102TA.pdf; Supplier 1: Digi-Key; Supplier Part Number 1: 587-1299-1-ND
C53 = C0402_a_100pF: Ceramic Chip Capacitor - 100pF; Note: Footprint corresponds to dimensions for bulk cassette packaging. This case size has tightened tolerances.; Published: 17-Jul-2002; LatestRevisionDate: 19-Mar-2004; LatestRevisionNote: Silkscreen size reduced.; DatasheetDocument: Mar-2001; PackageDocument: Mar-2001; PackageReference: 0402; Publisher: Altium Limited; Code_JEITA: 0402; Code_IPC: 1005 [0402]; ComponentLink1Description: Manufacturer Link; ComponentLink1URL: http://www.kemet.com/; ComponentLink2Description: Datasheet; ComponentLink2URL: http://www.kemet.com/kemet/web/homepage/kechome.nsf/vapubfilesname/F3102TA.pdf/$file/F3102TA.pdf; Supplier 1: Digi-Key; Supplier Part Number 1: 399-3194-1-ND
FB1 = Murata_a_0805_30_Ohm_100Mhz: FERRITE CHIP 30 OHM 3000MA 0805; Supplier 1: Digi-Key; Supplier Part Number 1: 490-1052-1-ND
JP3 = Ethernet connector: CONN PULSEJACK 1PORT 10/100B-TX; Manufacturer: Pulse; Supplier 1: Digi-Key
R21 R22 = Susumu_0805_a3_200: RES 200 OHM 1/10W .5% 0805 SMD; Supplier 1: Digi-Key; Supplier Part Number 1: RR12P200DCT-ND
R27 = Stackpole_0805_b1_6.49K: RES 6.49K OHM 1/4W 1% 0805 SMD; Supplier 1: Digi-Key; Supplier Part Number 1: RNCP0805FTD6K49CT-ND
R31-R34 = Susumu_0805_a1_49.9: RES 49.9 OHM 1/10W .5% 0805 SMD; Manufacturer: Susumu; Supplier 1: Digi-Key; Supplier Part Number 1: RR12Q49.9DCT-ND; Datasheet: http://www.susumu-usa.com/pdf/products_12.pdf
U4 = 10Base-T/100Base-TX Physical Layer Transceiver: Manufacturer: Micrel INC.; Supplier 1: Digi-Key
X3 = Crystal_25.000MHz: Crystal 25.000MHz 18PF SMD; Manufacturer: Abracon Corporation; Value: 25MHz; Supplier 1: Digi-Key
R28 = Vishay_0805_a1_0.0: Supplier 1: Digi-Key; Supplier Part Number 1: MCU0805-0.0-ZZCT-ND

## Nets that join several sheets
GND: MCU (63 pins), Power_Regulator (19 pins), SDCARD (C50.1 C113.2 JP1.6), Ethernet (20 pins)
1V: MCU (13 pins), Power_Regulator (7 pins)
3V3: MCU (20 pins), Power_Regulator (9 pins), SDCARD (C113.1 FB3.2 RM1.2), Ethernet (6 pins)
AVDD: MCU (C15.2 C16.2 U1.R4 U1.U2), Power_Regulator (FB4.2)
NRST: MCU (C46.2 JP4.15 U1.G15), Power_Regulator (J21.1 R111.1), Ethernet (U4.32)
PA6: MCU (U1.T10), SDCARD (JP1.7)
PA7: MCU (U1.P13), SDCARD (JP1.3 RM1.1), Ethernet (R28.1)
PA8: MCU (U1.T11), SDCARD (JP1.5)
PA9: MCU (U1.P14), SDCARD (JP1.8)
PA10: MCU (U1.R13), SDCARD (JP1.1), Ethernet (U4.26)
PA11: MCU (U1.T12), SDCARD (JP1.2), Ethernet (U4.27)
PA12: MCU (U1.U9), Ethernet (U4.24)
PA13: MCU (U1.U10), Ethernet (U4.25)
PA14: MCU (U1.U11), Ethernet (U4.16)
PA15: MCU (U1.U12), Ethernet (U4.15)
PA16: MCU (U1.U15), Ethernet (U4.23)
PA17: MCU (U1.U14), Ethernet (U4.18)
PA18: MCU (U1.U16), Ethernet (U4.20)
PA19: MCU (U1.U13), Ethernet (U4.22)
PA20: MCU (U1.T14), Ethernet (U4.12)
PA21: MCU (U1.R14), Ethernet (U4.11)
PA25: MCU (U1.P16), Ethernet (U4.14)
PA26: MCU (U1.P15), Ethernet (U4.13)
PA27: MCU (U1.T17), Ethernet (U4.19)
PA28: MCU (U1.L14), Ethernet (U4.29)
PA29: MCU (U1.R17), Ethernet (U4.28)
VDDBU: MCU (C14.2 JP40.3 R30.2 U1.D16), Power_Regulator (FB6.2)
VMain: MCU (JP5.3), Power_Regulator (J22.1 U7.3 U7.11 U7.12)